# Altium project LED_Flasher.PrjPcb
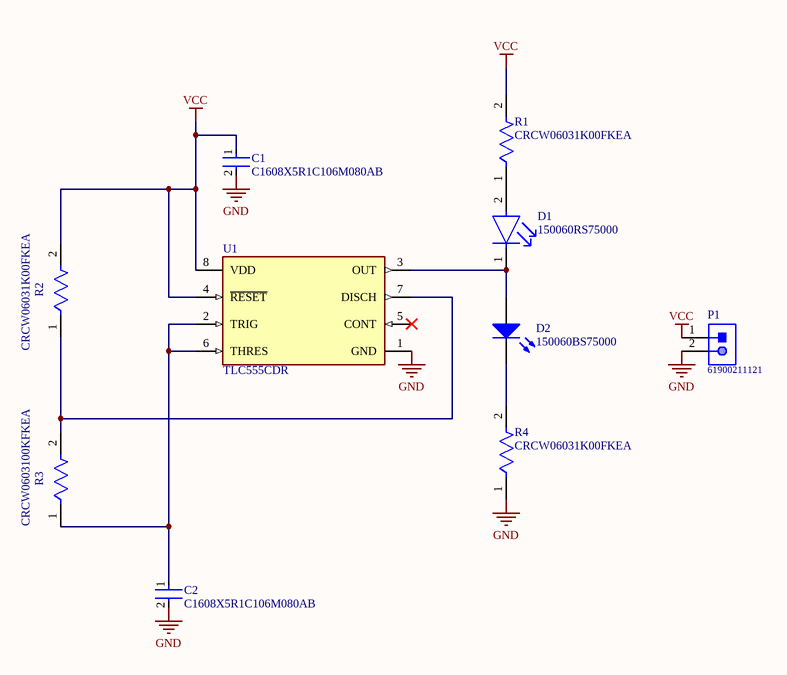
[diagram p0: Led_Flasher.SchDoc]
1 sheet, 10 parts. Net scope: global (net labels, ports and power ports of the same name join across sheets).
Board file: LED_Flasher.PcbDoc

## Sheet Led_Flasher.SchDoc
size A4; SheetNumber: 1; SheetTotal: 1

### Parts
C1  C1608X5R1C106M080AB  [FP-C1608-MFG]
C2  C1608X5R1C106M080AB  [FP-C1608-MFG]
D1  150060RS75000  [FP-150060RS75000-MFG]
D2  150060BS75000  [0603_A]
P1  61900211121  [61900211121]
R1  CRCW06031K00FKEA  [FP-CRCW0603-e3-MFG]
R2  CRCW06031K00FKEA  [FP-CRCW0603-e3-MFG]
R3  CRCW0603100KFKEA  [FP-CRCW0603-e3-IPC_C]
R4  CRCW06031K00FKEA  [FP-CRCW0603-e3-MFG]
U1  TLC555CDR  [FP-D0008A-IPC_B]

### Nets
GND: C1.2 C2.2 P1.2 R4.1 U1.1(GND)
VCC: C1.1 P1.1 R1.2 R2.2 U1.4(~{RESET}) U1.8(VDD)
NetC2_1: C2.1 R3.1 U1.2(TRIG) U1.6(THRES)
NetD1_1: D1.1(C) D2.2(A) U1.3(OUT)
NetD1_2: D1.2(A) R1.1
NetD2_1: D2.1(K) R4.2
NetR2_1: R2.1 R3.2 U1.7(DISCH)

Not connected (* = marked no-connect by the designer): U1 5(CONT)*

### Library data of the parts
C1 C2 = CMP-08246-000019-1: CAP CER 10UF 16V X5R 0603; Manufacturer: TDK Corporation; Temperature Coefficient: 15%; Tolerance: 20%; Material: Ceramic; Octopart: https://octopart.com/c1608x5r1c106m080ab-tdk-26013480; ComponentLink2Description: Datasheet; Value: 10uF; Temperature Range Low: -55°C; Digikey Description: CAP CER 10UF 16V X5R 0603; Package: C1608; Lead Free: Yes; Mouser Description: Multilayer Ceramic Capacitors MLCC - SMD/SMT 0603 10uF 16volts X5R +/-20% GP; Device Class L2: Capacitors; Voltage Rating: 16V; Manufacturer Part Number: C1608X5R1C106M080AB; RoHS: TRUE; Automotive: No; Height: 0.9mm; Ipc Land Pattern Name: CAPC16080X80; ComponentLink2URL: https://upverter.com/datasheet/6fbac97fd59b4a24a005814037d2a36a27db40e9.pdf; Temperature Range High: +85°C; Capacitance: 10uF; Temperature: -55°C to +85°C; Category: Cap; Device Class L1: Passive Components; Device Class L3: Ceramic Capacitors; Temperature Characteristic: X5R
D1 = CMP-1426-00001-2: LED RED CLEAR 0603 SMD; Luminous Intensity: 250mcd; Viewing Angle: 140°; Dominant Wavelength: 625nm; Test Current: 20mA; Forward Current: 30mA; Forward Voltage: 2V; Lens Color: Colorless; Lens Size: 0.7mm; Width: 0.8mm; Series: WL-SMCW; Color: Red; Min Operating Temperature: -40°C; RoHS Compliant: Yes; Height: 0.8mm; Package Quantity: 1; Packaging: Cut Tape; Mount: Surface Mount; Case/Package: 0603; Lens Transparency: Clear; Length: 1.6mm; Case Code (Imperial): 0603; Lens Style: Clear; Wavelength: 625nm; Max Operating Temperature: 85°C; Case Code (Metric): 1608
D2 = CMP-1426-00003-1: SMD mono-color Chip LED, WL-SMCW, Blue; Manufacturer: Wuerth Elektronik; Color: Blue; ComponentLink2Description: Datasheet; ComponentLink2URL: http://katalog.we-online.com/led/datasheet/150060BS75000.pdf; ComponentLink1URL: http://www.we-online.com; PackageReference: 0603_A; PartNumber: 150060BS75000; ComponentLink1Description: Manufacturer URL
P1 = CMP-1502-00584-1: Male Locking Header WR-WTB, THT, Vertical, pitch 2.54 mm, 1 x 2 position; Manufacturer: Wurth Elektronik; Position: 1x2; Contact Resistance: 20mOhm; Working Voltage: 250VAC; Pitch: 2.54mm; Gender: Male; Part Number: 61900211121; Mounting Technology: THT; Operating Temperature: -40to105degC; Orientation: Vertical; Packaging: Bag; Package Reference: 61900211121; Manufacturer URL: http://www.we-online.de; Datasheet URL: https://katalog.we-online.de/em/datasheet/6190xx11121.pdf; Publisher: WurthElektronik
R1 R2 R4 = CMP-1666-00003-5: RES Thick Film, 1kΩ, 1%, 0.1W, 100ppm/°C, 0603; Max Power Dissipation: 100mW; Voltage Rating: 75V; Resistance: 1kR; Max Operating Temperature: 155°C; Number of Pins: 2; Case Code (Imperial): 0603; Width: 0.033inch; Power Rating: 100mW; Number of Terminations: 2; Package Quantity: 10; Weight: 7.1E-05oz; Tolerance: 1%; Temperature Coefficient: 100ppm/°C; Military Standard: Not; Mount: Surface Mount; Voltage Rating (DC): 75V; Depth: 0.85mm; Composition: Thick Film; Radiation Hardening: No; Termination: SMD/SMT; Length: 1.55mm; Case Code (Metric): 1608; Contact Plating: Tin; Min Operating Temperature: -55°C; Packaging: Tape and Reel; Height: 0.45mm; Lead Free: Lead Free; Case/Package: 0603; Features: Automotive AEC-Q200
R3 = CMP-2000-03820-2: RES Thick Film, 100kΩ, 1%, 0.1W, 100ppm/°C, 0603; Power Rating: 100mW; Voltage Rating (DC): 75V; Resistance: 100kR; Width: 0.033inch; Temperature Coefficient: 100ppm/°C; Case/Package: 0603; Max Operating Temperature: 155°C; Packaging: Tape and Reel; Number of Pins: 2; Termination: SMD/SMT; Case Code (Metric): 1608; Composition: Thick Film; Radiation Hardening: No; Min Operating Temperature: -55°C; Voltage Rating: 75V; Lead Free: Lead Free; Number of Terminations: 2; Height: 0.45mm; Case Code (Imperial): 0603; Features: Automotive AEC-Q200; Length: 1.55mm; Max Power Dissipation: 100mW; Package Quantity: 10; Military Standard: Not; Tolerance: 1%; Depth: 0.85mm; Contact Plating: Tin; Weight: 7.1E-05oz
U1 = CMP-04857-000001-1: IC OSC SGL TIMER 2.1MHZ 8-SOIC; Min Supply Voltage: 2V; Number of Channels: 1; Max Power Dissipation: 725mW; Max Supply Voltage: 15V; Low Level Output Current: 100mA; Current Rating: 250A; Quiescent Current: 250uA; Operating Supply Current: 360uA; High Level Output Current: -10mA; Width: 3.91mm; Case/Package: SOIC; Weight: 0.002561oz; Frequency: 2.1MHz; Height: 1.58mm; Package Quantity: 2500; REACH SVHC: No SVHC; Number of Timers/Counters: 1; Lead Free: Lead Free; Number of Pins: 8; Max Operating Temperature: 125°C; Min Operating Temperature: -40°C; Length: 4.9mm; Radiation Hardening: No; Packaging: Tape and Reel; Termination: SMD/SMT; Mount: Surface Mount; Power Dissipation: 725mW